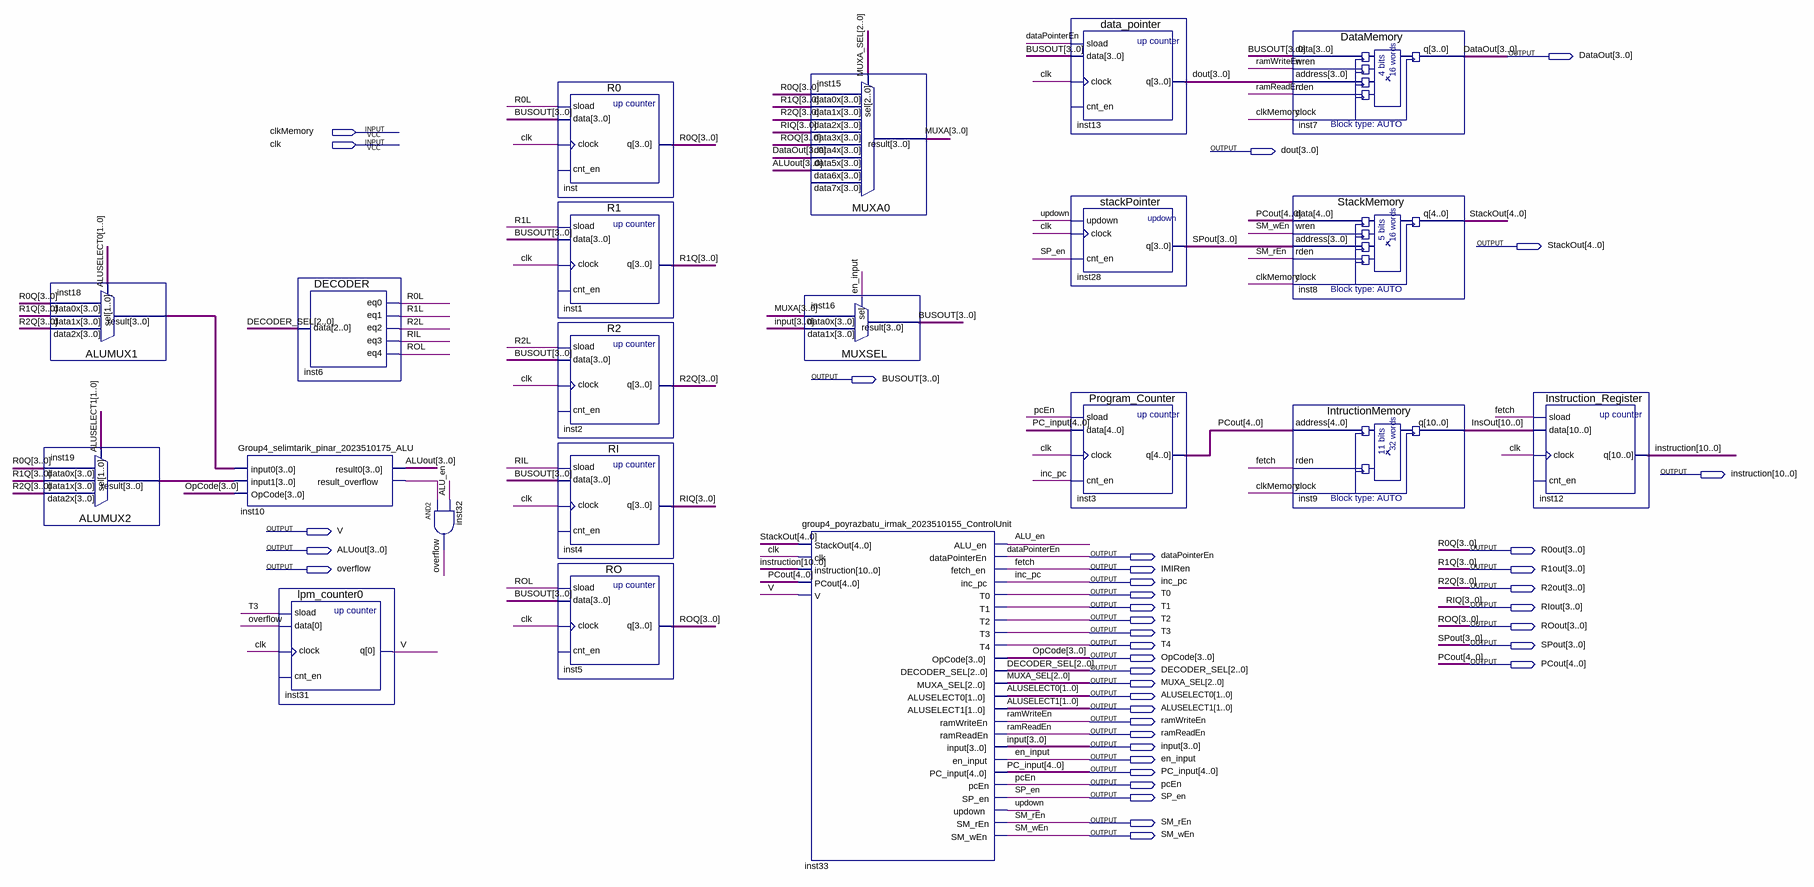
[diagram p0: schematic sheet]
// Quartus schematic group4_selimtarik_pinar_2023510175_BUS.bdf as structural Verilog: 21 symbols, 39 pins
module group4_selimtarik_pinar_2023510175_BUS (
  input  clkMemory,
  input  clk,
  output [3:0] DataOut,
  output [3:0] dout,
  output [4:0] StackOut,
  output [3:0] BUSOUT,
  output [10:0] instruction,
  output V,
  output [3:0] ALUout,
  output [3:0] R0out,
  output dataPointerEn,
  output overflow,
  output IMIRen,
  output [3:0] R1out,
  output inc_pc,
  output [3:0] R2out,
  output T0,
  output T1,
  output [3:0] RIout,
  output T2,
  output [3:0] ROout,
  output T3,
  output T4,
  output [3:0] SPout,
  output [3:0] OpCode,
  output [4:0] PCout,
  output [2:0] DECODER_SEL,
  output [2:0] MUXA_SEL,
  output [1:0] ALUSELECT0,
  output [1:0] ALUSELECT1,
  output ramWriteEn,
  output ramReadEn,
  output [3:0] \input ,
  output en_input,
  output [4:0] PC_input,
  output pcEn,
  output SP_en,
  output SM_rEn,
  output SM_wEn
);

  wire ALU_en, inst10_result_overflow, R0L, R1L, R2L, RIL, ROL, updown;
  wire [3:0] inst18_result, inst19_result, MUXA;
  wire [10:0] InsOut;

  ALUMUX1 inst18 (.data2x(R2out), .data1x(R1out), .data0x(R0out), .sel(ALUSELECT0), .result(inst18_result));
  ALUMUX2 inst19 (.data2x(R2out), .data1x(R1out), .data0x(R0out), .sel(ALUSELECT1), .result(inst19_result));
  Group4_selimtarik_pinar_2023510175_ALU inst10 (
    .input0(inst18_result), .input1(inst19_result), .OpCode(OpCode), .result0(ALUout),
    .result_overflow(inst10_result_overflow));
  DECODER inst6 (.data(DECODER_SEL), .eq0(R0L), .eq1(R1L), .eq2(R2L), .eq3(RIL), .eq4(ROL));
  lpm_counter0 inst31 (.sload(T3), .data(overflow), .clock(clk), .q(V));  // open: cnt_en
  and inst32 (overflow, inst10_result_overflow, ALU_en);
  R0 inst (.sload(R0L), .data(BUSOUT), .clock(clk), .q(R0out));  // open: cnt_en
  R1 inst1 (.sload(R1L), .data(BUSOUT), .clock(clk), .q(R1out));  // open: cnt_en
  R2 inst2 (.sload(R2L), .data(BUSOUT), .clock(clk), .q(R2out));  // open: cnt_en
  RI inst4 (.sload(RIL), .data(BUSOUT), .clock(clk), .q(RIout));  // open: cnt_en
  RO inst5 (.sload(ROL), .data(BUSOUT), .clock(clk), .q(ROout));  // open: cnt_en
  MUXA0 inst15 (
    .data6x(ALUout), .data5x(DataOut), .data4x(ROout), .data3x(RIout), .data2x(R2out), .data1x(R1out),
    .data0x(R0out), .sel(MUXA_SEL), .result(MUXA));  // open: data7x
  MUXSEL inst16 (.data1x(\input ), .data0x(MUXA), .sel(en_input), .result(BUSOUT));
  group4_poyrazbatu_irmak_2023510155_ControlUnit inst33 (
    .StackOut(StackOut), .clk(clk), .instruction(instruction), .PCout(PCout), .V(V), .ALU_en(ALU_en),
    .dataPointerEn(dataPointerEn), .fetch_en(IMIRen), .inc_pc(inc_pc), .T0(T0), .T1(T1), .T2(T2), .T3(T3),
    .T4(T4), .OpCode(OpCode), .DECODER_SEL(DECODER_SEL), .MUXA_SEL(MUXA_SEL), .ALUSELECT0(ALUSELECT0),
    .ALUSELECT1(ALUSELECT1), .ramWriteEn(ramWriteEn), .ramReadEn(ramReadEn), .\input (\input ),
    .en_input(en_input), .PC_input(PC_input), .pcEn(pcEn), .SP_en(SP_en), .updown(updown), .SM_rEn(SM_rEn),
    .SM_wEn(SM_wEn));
  data_pointer inst13 (.sload(dataPointerEn), .data(BUSOUT), .clock(clk), .q(dout));  // open: cnt_en
  stackPointer inst28 (.updown(updown), .clock(clk), .cnt_en(SP_en), .q(SPout));
  Program_Counter inst3 (.sload(pcEn), .data(PC_input), .clock(clk), .cnt_en(inc_pc), .q(PCout));
  DataMemory inst7 (.data(BUSOUT), .wren(ramWriteEn), .address(dout), .rden(ramReadEn), .clock(clkMemory), .q(DataOut));
  StackMemory inst8 (.data(PCout), .wren(SM_wEn), .address(SPout), .rden(SM_rEn), .clock(clkMemory), .q(StackOut));
  IntructionMemory inst9 (.address(PCout), .rden(IMIRen), .clock(clkMemory), .q(InsOut));
  Instruction_Register inst12 (.sload(IMIRen), .data(InsOut), .clock(clk), .q(instruction));  // open: cnt_en

  // Other names for the same wires on the sheet: fetch = IMIRen; R0Q[3:0] = R0out; R1Q[3:0] = R1out; R2Q[3:0] = R2out;
  //   RIQ[3:0] = RIout; ROQ[3:0] = ROout
endmodule
